# EasyEDA Pro project mouse.eprj

# Schematic Schematic1

## Sheets
1 P1: Board Name: Board1; Create Date: 2025-05-03; Page Name: P1; Project Name: mouse; Schematic Name: Schematic1; Update Date: 2025-05-28; Company: 嘉立创EDA; Page Size: A4; Version: V1.0
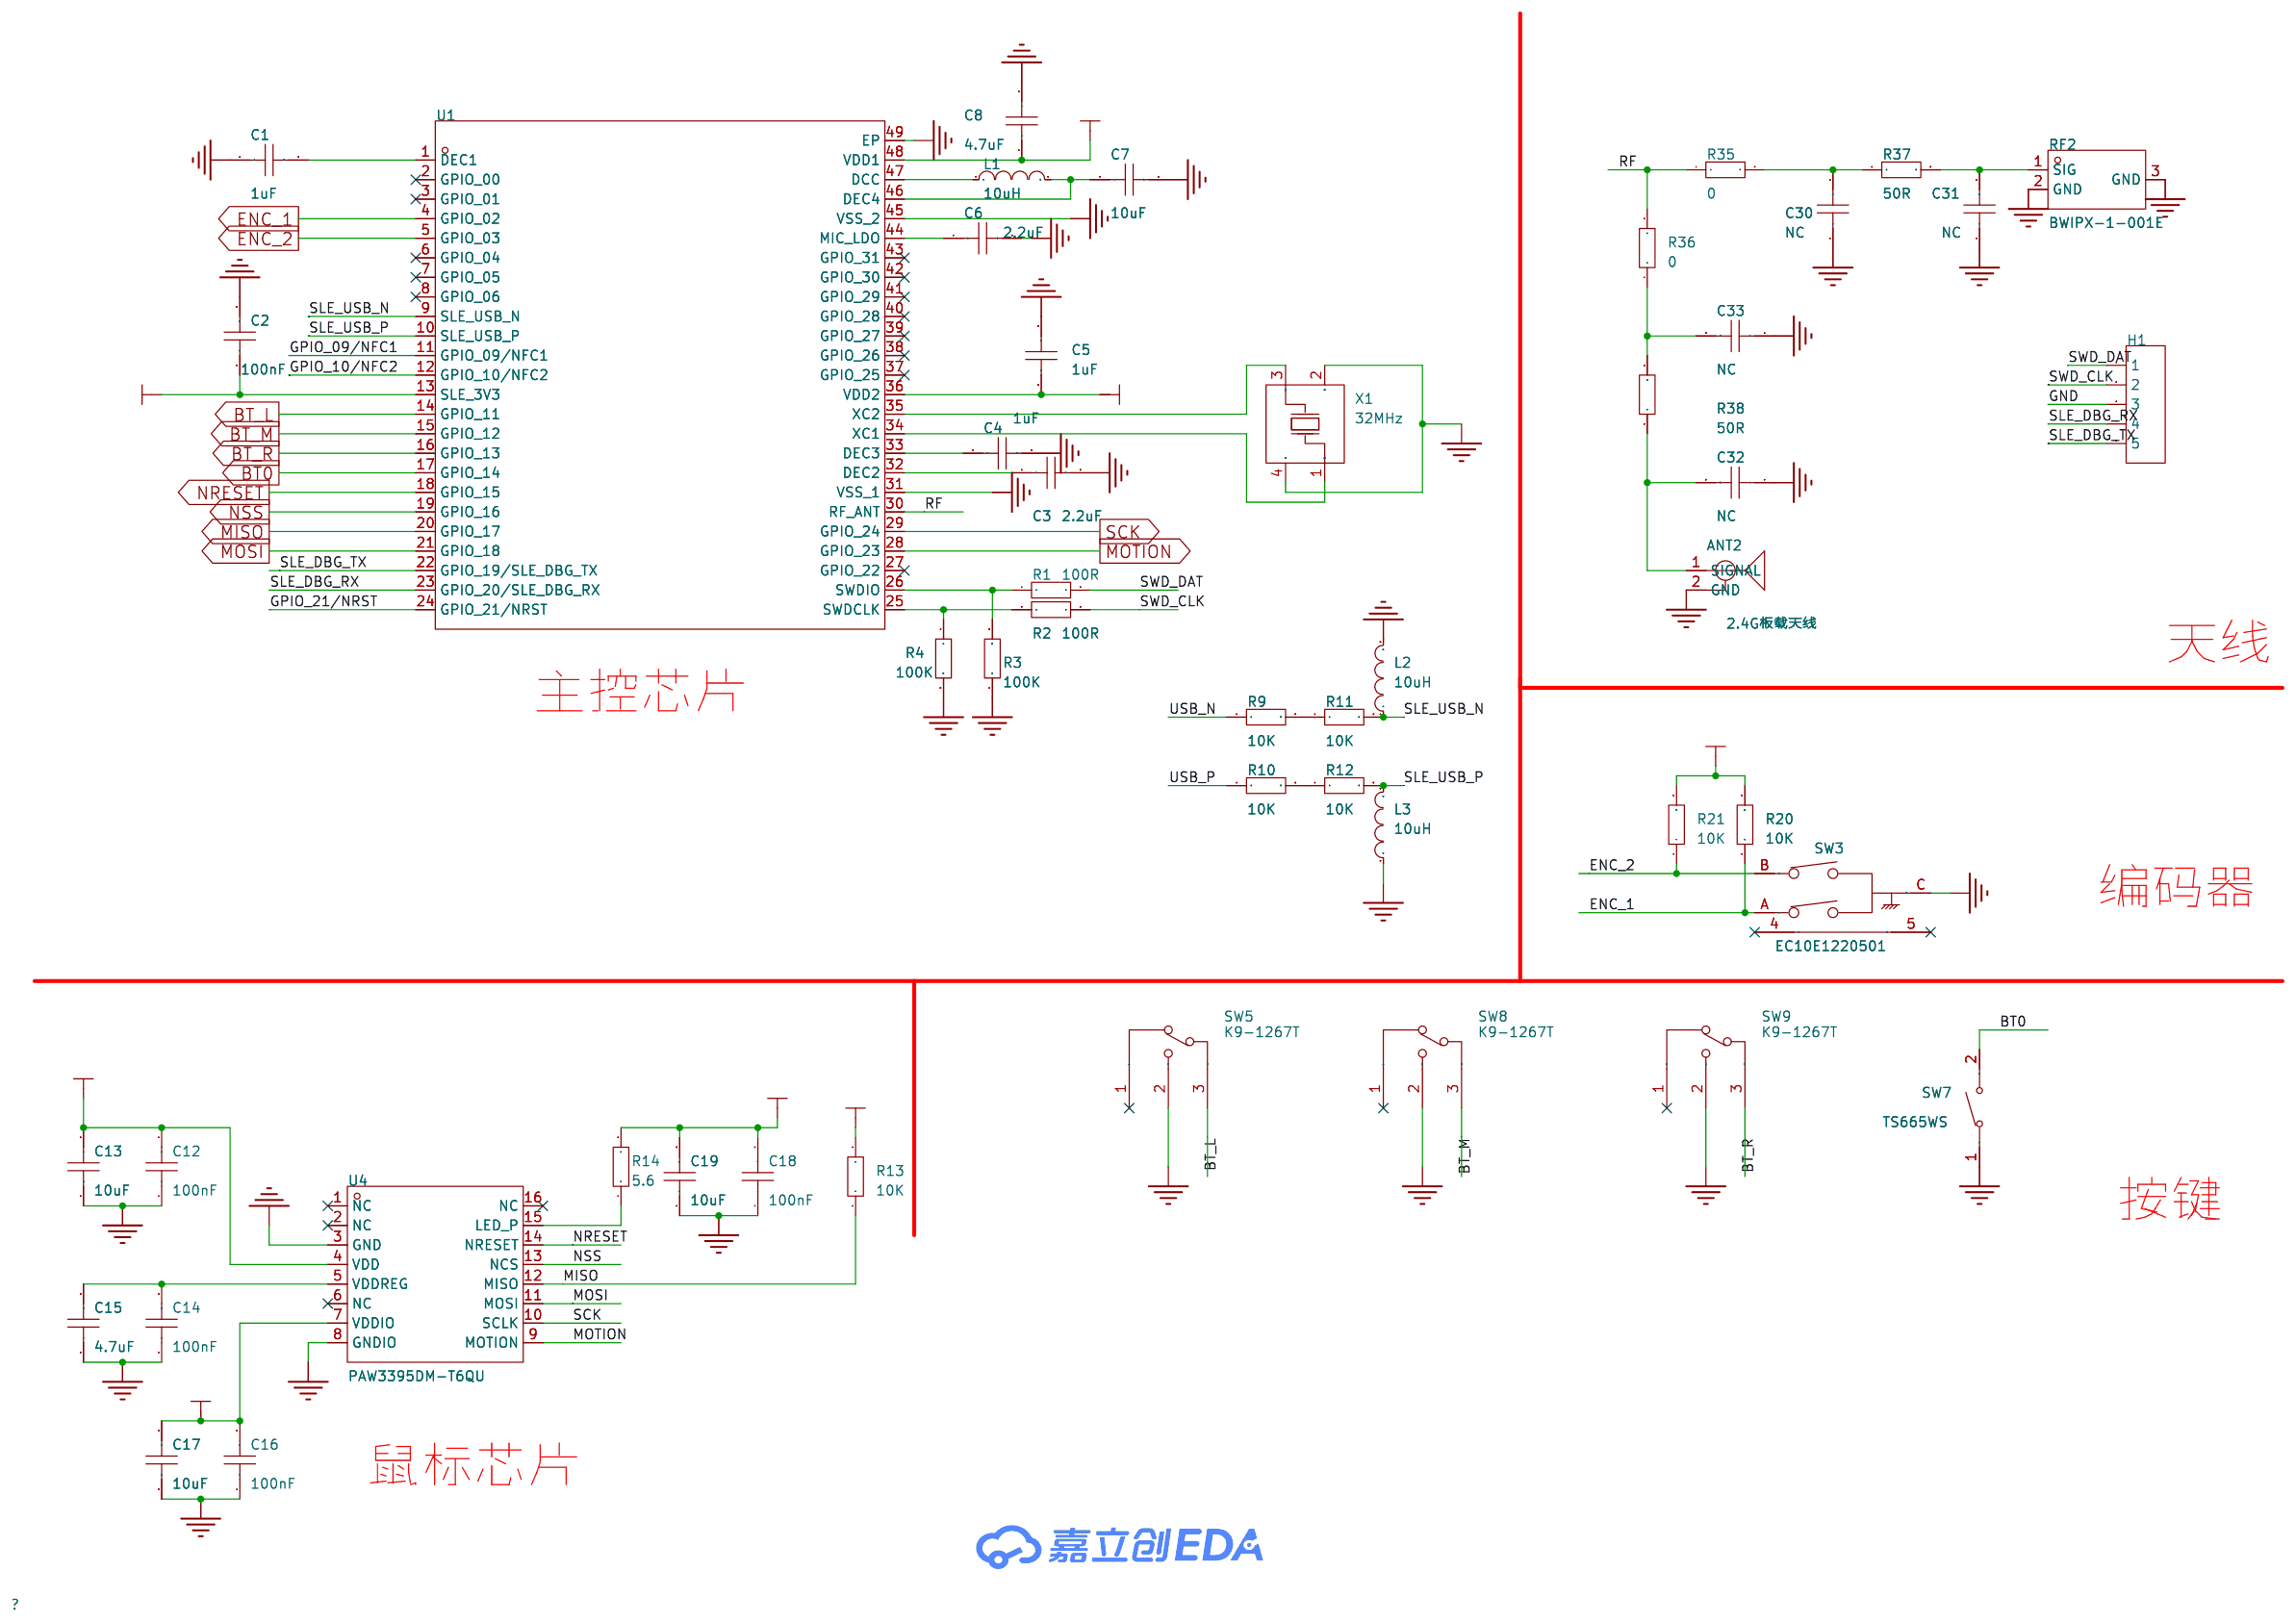
[diagram p0: P1]
2 P2: Page Name: P2; Update Date: 2025-05-03
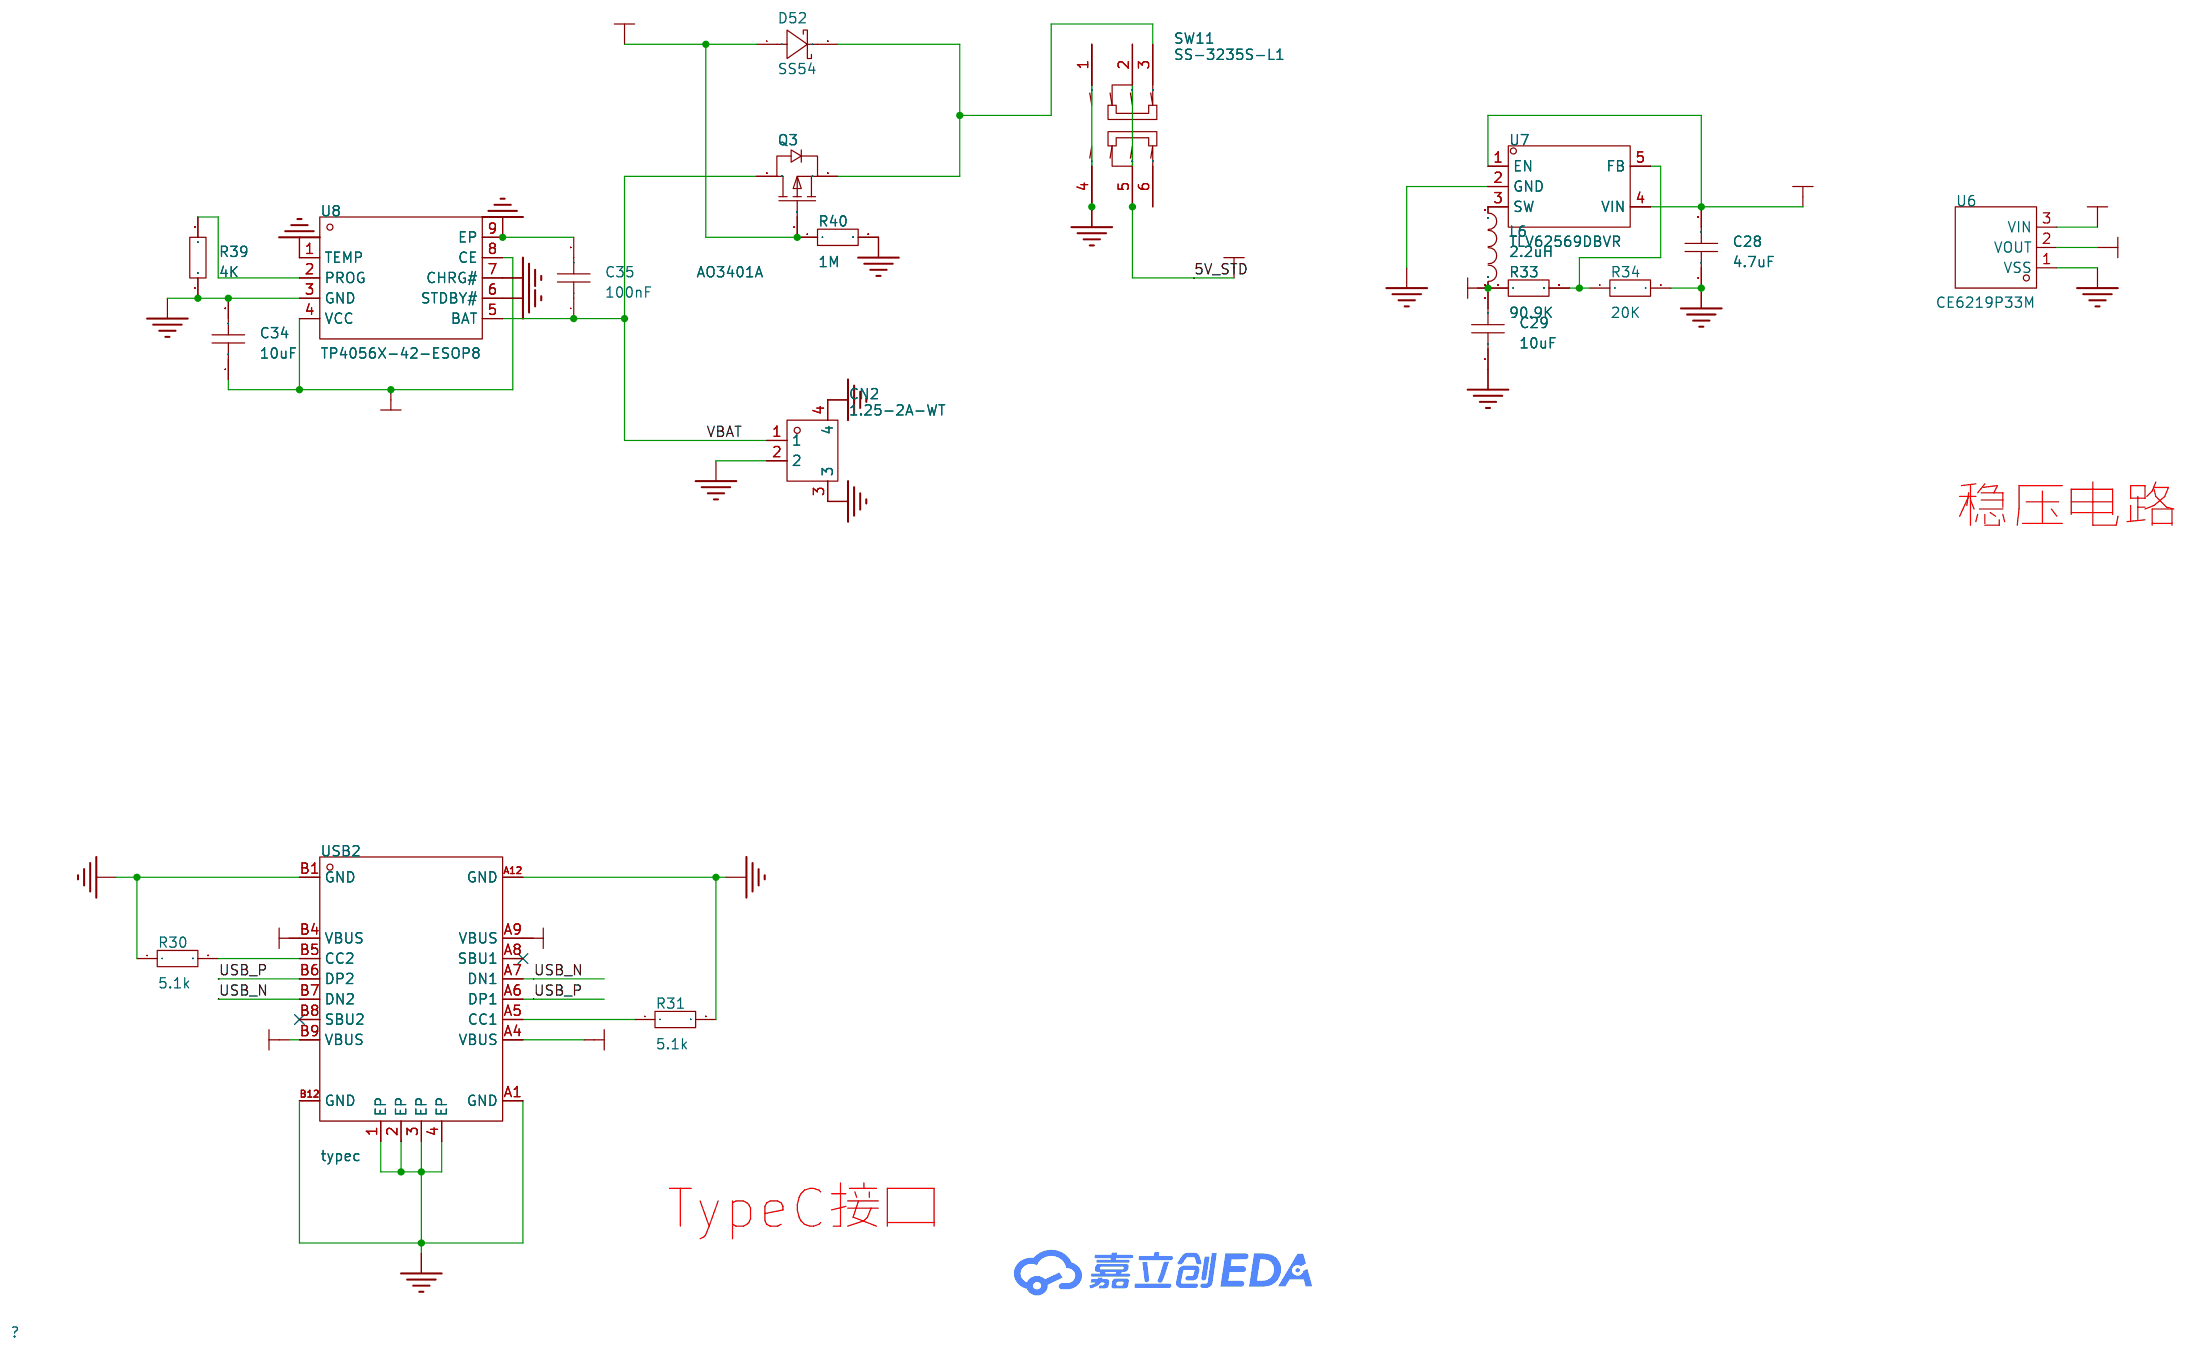
[diagram p1: P2]

## Parts
sheet P1
ANT2  2.4G板载天线  [ANT-2.4G]
C1  1uF  [C0402]
C2  100nF  [C0402]
C3  2.2uF  [C0402]
C4  1uF  [C0402]
C5  1uF  [C0402]
C6  2.2uF  [C0402]
C7  10uF  [C0603]
C8  4.7uF  [C0402]
C12  100nF  [C0603]
C13  10uF  [C0603]
C14  100nF  [C0603]
C15  4.7uF  [C0603]
C16  100nF  [C0603]
C17  10uF  [C0603]
C18  100nF  [C0603]
C19  10uF  [C0603]
C30  NC  [C0201]
C31  NC  [C0201]
C32  NC  [C0201]
C33  NC  [C0201]
H1  -  [HDR-TH_5P-P2.54-V-F]
L1  10uH  [L0805]
L2  10uH  [L0402]
L3  10uH  [L0402]
R1  100R  [R0402]
R2  100R  [R0402]
R3  100K  [R0402]
R4  100K  [R0402]
R9  10K  [R0402]
R10  10K  [R0402]
R11  10K  [R0402]
R12  10K  [R0402]
R13  10K  [R0603]
R14  5.6  [R0603]
R20  10K  [R0603]
R21  10K  [R0603]
R35  0  [R0201]
R36  0  [R0201]
R37  50R  [R0201]
R38  50R  [R0201]
RF2  BWIPX-1-001E  [IPEX-SMD_BWIPX-1-001E]
SW3  EC10E1220501  [SW-TH_EC10EXXXXXXX]
SW5  K9-1267T  [SW-TH_K9-1267T]
SW7  TS665WS  [SW-SMD_L6.0-W6.0-LS6.6]
SW8  K9-1267T  [SW-TH_K9-1267T]
SW9  K9-1267T  [SW-TH_K9-1267T]
U1  -  [QFN-48_L6.0-W6.0-P0.40-TL-EP4.4]
U4  PAW3395DM-T6QU  [DIP-16_PAW3395DM-T6QU]
X1  32MHz  [OSC-SMD_4P-L2.0-W1.6-BL]
sheet P2
C28  4.7uF  [C0603]
C29  10uF  [C0603]
C34  10uF  [C0603]
C35  100nF  [C0402]
CN2  1.25-2A-WT  [CONN-TH_1.25-2A-WT]
D52  SS54  [SMA_L4.3-W2.6-LS5.0-FD]
L6  2.2uH  [IND-SMD_L4.4-W4.2]
Q3  AO3401A  [SOT-23_L2.9-W1.3-P1.90-LS2.4-BR]
R30  5.1k  [R0603]
R31  5.1k  [R0603]
R33  90.9K  [R0402]
R34  20K  [R0402]
R39  4K  [R0402]
R40  1M  [R0402]
SW11  SS-3235S-L1  [SW-SMD_SS-3235S-LX]
U6  CE6219P33M  [SOT-23-3_L2.9-W1.6-P1.90-LS2.8-BR]
U7  TLV62569DBVR  [SOT-23-5_L3.0-W1.7-P0.95-LS2.8-BR]
U8  TP4056X-42-ESOP8  [SOP-8_L4.9-W3.9-P1.27-LS6.0-TL-EP]
USB2  typec  [USB-C-SMD_KH-TYPE-C-16P]

## Library data of the parts
ANT2 = 2.4G板载天线
C1-C6 C8 C28-C35 = CAP_0402: Supplier Footprint: 0402
C7 C12-C19 = CAP_0603: Supplier Footprint: 0603
H1 = HDR-F_2.54_1x5P: Supplier Part: C50950; Supplier Footprint: 插件
L1 = L_0805
L2 L3 = L_0603: Supplier Footprint: L0603
R1-R4 R33 R34 R39 R40 = Res_0402: Supplier Footprint: 0402
R9-R14 R20 R21 R30 R31 = Res_0603: Supplier Footprint: 0603
R35-R38 = Res_0201: Supplier Footprint: 0201
RF2 = BWIPX-1-001E: 连接器类型:板端;接口类型:内针;端口数量:1;接口直径:-;接口长度/高度:-;频率-最大值:6GHz;射频系列:IPEX;阻抗:50Ω;样式:-;工作温度范围:-;; LCSC Part Name: IPEX 内针; Supplier Part: C496552; Manufacturer: BAT WIRELESS(蝙蝠无线); Supplier Footprint: SMD; JLCPCB Part Class: Extended Part; Datasheet: https://atta.szlcsc.com/upload/public/pdf/source/20201223/C496552_05E5A9956EAE1A8819C5051D085B1DED.pdf; Supplier: LCSC; Connector Type: 板端; Interface Type: 内针; Number of Ports: 1; Frequency-Max: 6GHz; RF Series: IPEX; Impedance: 50Ω
SW3 = EC10E1220501: 10型贯通轴型; Supplier Part: C160889; Manufacturer: ALPSALPINE(阿尔卑斯阿尔派); Supplier Footprint: 插件; JLCPCB Part Class: 扩展库; Datasheet: https://atta.szlcsc.com/upload/public/pdf/source/20180227/C160889_15197014267581370273.pdf; Supplier: LCSC
SW5 SW8 SW9 = K9-1267T: 类型:微动开关;电路结构:单刀双掷;额定电流(DC):100mA;额定电压(DC):30V;额定电流(AC):-;额定电压(AC):-;机械寿命:300万次;; LCSC Part Name: 12.7*5.7*7.5mm 插件微动开关; Supplier Part: C107266; Manufacturer: 韩国韩荣; Supplier Footprint: 插件; JLCPCB Part Class: 扩展库; Datasheet: https://atta.szlcsc.com/upload/public/pdf/source/20170413/1492062748888.pdf; Supplier: LCSC; Type: 微动开关; Circuit: 单刀双掷; Switch Length: 12.7mm; Switch Width: 5.7mm; Switch Height: 7.5mm; Contact Current (DC): 100mA; Voltage Rating (DC): 30V; Mechanical Life: 300万次; Operating Temperature: -25℃~+85℃
SW7 = TS665WS_C398058: 电路结构:单刀单掷;按钮形状:圆形按钮;作用力:200gf;安装方式:立贴;开关长度:6mm;开关宽度:6mm;开关高度:5mm;触点电流:50mA;额定电压(DC):12V;带灯:-;机械寿命:-;; LCSC Part Name: 6*6*5mm 立贴 轻触开关; Supplier Part: C398058; Manufacturer: SHOU HAN(首韩); Supplier Footprint: SMD; JLCPCB Part Class: 扩展库; Datasheet: https://atta.szlcsc.com/upload/public/pdf/source/20190620/C398058_75EC11C2CCBC6DD113AE79D58CB25A40.pdf; Supplier: LCSC; Circuit: 单刀单掷; Actuator Style: 圆形按钮; Operating Force: 200gf; Mounting Style: 立贴; Switch Length: 6mm; Switch Width: 6mm; Switch Height: 5mm; Contact Current: 50mA; Voltage Rating (DC): 12V
U1 = hi2821: Manufacturer: 海思; Supplier Footprint: QFN-48; JLCPCB Part Class: 扩展库
U4 = PAW3395DM-T6QU: Supplier Part: C9900026543; Supplier Footprint: 16-PDIP; Supplier: LCSC
X1 = X201632MKD4SI: 晶振类型:贴片晶振;频率:32MHz;常温频差:±20ppm;外接负载电容:8pF;频率稳定度(全温):±20ppm;; LCSC Part Name: 32MHz ±20ppm 8pF 停产; Supplier Part: C108165; Manufacturer: YXC(扬兴晶振); Supplier Footprint: SMD2016-4P; JLCPCB Part Class: 扩展库; Datasheet: https://atta.szlcsc.com/upload/public/pdf/source/20210329/C108154_97241DDF47B5B71D7D93F8906D63DA2F.pdf; Supplier: LCSC; Crystal Type: 贴片晶振; Normal temperature Frequency Tolerance: ±20ppm; External load capacitor: 8pF; Frequency Stability(Full temperature range): ±20ppm; Operating Temperature: -40℃~+85℃
CN2 = 1.25-2A-WT: 插针结构:1x2P;间距:1.25mm;安装方式:卧贴;参考系列:-;总PIN数:2P;排数:1;每排PIN数:2;行距:-;额定电流:500mA;工作温度范围:-25℃~+85℃;; LCSC Part Name: 1x2P 间距:1.25mm 卧贴; Supplier Part: C722596; Manufacturer: CAX(创都); Supplier Footprint: SMD,P=1.25mm,卧贴; JLCPCB Part Class: 扩展库; Datasheet: https://atta.szlcsc.com/upload/public/pdf/source/20200831/C722596_8E06BADB8DB7299BF643CBA8EAB94548.pdf; Supplier: LCSC; Pins Structure: 1x2P; Pitch: 1.25mm; Mounting Style: 卧贴; Number of Pins: 2P; Number of Rows: 1; Number of PINs Per Row: 2; Current Rating (Max): 500mA; Operating Temperature Range: -25℃~+85℃
D52 = SS54_C7420369: 二极管配置:独立式;正向压降(Vf):550mV@5.0A;直流反向耐压(Vr):40V;整流电流:5A;; LCSC Part Name: 电压:40V 电流:5A; Supplier Part: C7420369; Manufacturer: 宏迦橙; Supplier Footprint: SMA(DO-214AC); JLCPCB Part Class: 扩展库; Datasheet: https://atta.szlcsc.com/upload/public/pdf/source/20230828/254C3882F8647358AD9F60DD73611B5E.pdf; Supplier: LCSC; Diode Configuration: 独立式; Forward Voltage (Vf@If): 550mV@5.0A; Reverse Voltage (Vr): 40V; Rectified Current: 5A; Reverse Leakage Current (Ir): 50uA@40V
L6 = FXL0420-2R2-M: 电感值:2.2uH;精度:±20%;额定电流:4.5A;饱和电流(Isat):5A;类型:一体成型电感;; LCSC Part Name: 2.2uH ±20% 5A; Supplier Part: C167206; Manufacturer: cjiang(长江微电); Supplier Footprint: SMD,4.2x4.4mm; JLCPCB Part Class: 扩展库; Datasheet: https://atta.szlcsc.com/upload/public/pdf/source/20240426/3189EA8206330E2108542F9E34E540E7.pdf; Supplier: LCSC; Tolerance: ±20%; Rated Current: 4.5A; Saturation Current (Isat): 5A; DC Resistance (DCR): 58mΩ; Type: 一体成型电感
Q3 = AO3401A_C15127: 类型:1个P沟道;漏源电压(Vdss):30V;连续漏极电流(Id):4A;导通电阻(RDS(on)@Vgs,Id):44mΩ@10V,4.3A;功率(Pd):1.4W;阈值电压(Vgs(th)@Id):1.3V@250uA;; LCSC Part Name: 1个P沟道 耐压:30V 电流:4A; Supplier Part: C15127; Manufacturer: AOS; Supplier Footprint: SOT-23; JLCPCB Part Class: 基础库; Datasheet: https://atta.szlcsc.com/upload/public/pdf/source/20160507/1462613609053.pdf; Supplier: LCSC; Type: 1个P沟道; Drain Source Voltage (Vdss): 30V; Continuous Drain Current (Id): 4A; Drain Source On Resistance (RDS(on)@Vgs,Id): 44mΩ@10V,4.3A; Power Dissipation (Pd): 1.4W; Gate Threshold Voltage (Vgs(th)@Id): 1.3V@250uA; Total Gate Charge (Qg@Vgs): 12.2nC@4.5V; Input Capacitance (Ciss@Vds): 1.2nF@15V; Operating Temperature: -55℃~+150℃@(Tj)
SW11 = SS-3235S-L1: 电路结构:双刀双掷;安装方式:卧贴;开关颜色:黑色;额定电流(DC):50mA;额定电压(DC):12V;额定电流(AC):50mA;额定电压(AC):12V;机械寿命:1万次;; LCSC Part Name: 柄长2mm 卧贴双档 滑动开关; Supplier Part: C500055; Manufacturer: XKB Connectivity(中国星坤); Supplier Footprint: SMD; JLCPCB Part Class: 扩展库; Datasheet: https://atta.szlcsc.com/upload/public/pdf/source/20211011/39D516E750C13BE9339464E723D9F132.pdf; Supplier: LCSC; Circuit: 双刀双掷; Actuator Style: 矩形柱状; Pin Style: 鸥翼型; Switch Length: 9.1mm; Switch Width: 3.55mm; Switch Height: 3.2mm; Mounting Style: 卧贴; Actuator Color: 黑色; Current Rating (DC): 50mA; Voltage Rating (DC): 12V; Current Rating (AC): 50mA; Voltage Rating (AC): 12V; Mechanical Life: 1万次; Operating Temperature: -40℃~+85℃
U6 = CE6219P33M: Supplier Part: C9900023885; Supplier Footprint: SOT-23; JLCPCB Part Class: 扩展库; Supplier: LCSC
U7 = TLV62569DBVR: 功能类型:降压型;输出类型:可调;输入电压:2.5V~5.5V;输出电压:600mV~5.5V;输出电流(最大值):2A;; Supplier Part: C141836; Manufacturer: TI(德州仪器); Supplier Footprint: SOT-23-5; JLCPCB Part Class: 扩展库; Datasheet: https://www.ti.com/cn/lit/gpn/tlv62569; Supplier: LCSC; Function: 降压型; Output Type: 可调; Input Voltage: 2.5V~5.5V; Output Voltage: 600mV~5.5V; Output Current (Max): 2A; Switching Frequency: 1.5MHz; Operating Temperature: -40℃~+125℃@(TJ); Synchronous Rectification: 是; Topology: 降压式; Switch tube (built-in/external): 内置
U8 = TP4056X-42-ESOP8: Supplier Part: C2763448; Manufacturer: TOPPOWER(南京拓微); Supplier Footprint: SOP-8-EP; JLCPCB Part Class: 扩展库; Datasheet: https://atta.szlcsc.com/upload/public/pdf/source/20221111/3D7D53D5011BF4ED4C4D0D9BFDBB1404.pdf; Supplier: LCSC
USB2 = typec: Supplier Part: C9900016956; Supplier Footprint: typec 12p; JLCPCB Part Class: 扩展库; Supplier: LCSC

## Nets
5V: C34.1 D52.1(A) Q3.1(G) R20.2 R21.2 R40.1 U8.4(VCC) U8.8(CE) USB2.A4(VBUS) USB2.A9(VBUS) USB2.B4(VBUS) USB2.B9(VBUS)
5V_STD: C28.2 SW11.2 SW11.5 U7.1(EN) U7.4(VIN)
GND: ANT2.2(GND) C1.1 C2.2 C3.2 C4.2 C5.2 C6.2 C7.2 C8.2 C12.1 C13.1 C14.1 C15.1 C16.1 C17.1 C18.1 C19.1 C28.1 C29.1 C30.1 C31.1 C32.1 C33.1 C34.2 C35.2 CN2.2 CN2.3 CN2.4 H1.3 L2.2 L3.1 R3.1 R4.2 R30.1 R31.2 R34.2 R39.1 R40.2 RF2.2(GND) RF2.3(GND) SW3.C SW5.2(ON) SW7.1(A) SW8.2(ON) SW9.2(ON) SW11.1 SW11.4 U1.31(VSS_1) U1.45(VSS_2) U1.49(EP) U4.3(GND) U4.8(GNDIO) U6.1(VSS) U7.2(GND) U8.1(TEMP) U8.3(GND) U8.6(STDBY#) U8.7(CHRG#) U8.9(EP) USB2.1(EP) USB2.2(EP) USB2.3(EP) USB2.4(EP) USB2.A1(GND) USB2.A12(GND) USB2.B1(GND) USB2.B12(GND) X1.2(GND) X1.4(GND)
VBAT: C35.1 CN2.1 Q3.3(D) U8.5(BAT)
VDD_1.9V: C12.2 C13.2 C18.2 C19.2 R14.2 U4.4(VDD) U6.2(VOUT)
BT0: SW7.2(B) U1.17(GPIO_14)
BT_L: SW5.3(NC) U1.14(GPIO_11)
BT_M: SW8.3(NC) U1.15(GPIO_12)
BT_R: SW9.3(NC) U1.16(GPIO_13)
ENC_1: R20.1 SW3.A U1.4(GPIO_02)
ENC_2: R21.1 SW3.B U1.5(GPIO_03)
GPIO_09/NFC1: U1.11(GPIO_09/NFC1)
GPIO_10/NFC2: U1.12(GPIO_10/NFC2)
GPIO_21/NRST: U1.24(GPIO_21/NRST)
MISO: R13.1 U1.20(GPIO_17) U4.12(MISO)
MOSI: U1.21(GPIO_18) U4.11(MOSI)
MOTION: U1.28(GPIO_23) U4.9(MOTION)
NRESET: U1.18(GPIO_15) U4.14(NRESET)
NSS: U1.19(GPIO_16) U4.13(NCS)
RF: R35.1 R36.2 U1.30(RF_ANT)
SCK: U1.29(GPIO_24) U4.10(SCLK)
SLE_3V3: C2.1 C5.1 C8.1 C16.2 C17.2 C29.2 L6.2 R13.2 R33.1 U1.13(SLE_3V3) U1.36(VDD2) U1.48(VDD1) U4.7(VDDIO) U6.3(VIN)
SLE_DBG_RX: H1.4 U1.23(GPIO_20/SLE_DBG_RX)
SLE_DBG_TX: H1.5 U1.22(GPIO_19/SLE_DBG_TX)
SLE_USB_N: L2.1 R11.2 U1.9(SLE_USB_N)
SLE_USB_P: L3.2 R12.2 U1.10(SLE_USB_P)
SWD_CLK: H1.2 R2.2
SWD_DAT: H1.1 R1.2
USB_N: R9.1 USB2.A7(DN1) USB2.B7(DN2)
USB_P: R10.1 USB2.A6(DP1) USB2.B6(DP2)
$1N1713: C6.1 U1.44(MIC_LDO)
$1N1734: C7.1 L1.2 U1.46(DEC4)
$1N1737: L1.1 U1.47(DCC)
$1N1785: R1.1 R3.2 U1.26(SWDIO)
$1N1790: R2.1 R4.1 U1.25(SWDCLK)
$1N1799: C4.1 U1.33(DEC3)
$1N1800: C3.1 U1.32(DEC2)
$1N1801: U1.34(XC1) X1.1(OSC1)
$1N1802: U1.35(XC2) X1.3(OSC2)
$1N1817: R10.2 R12.1
$1N1818: R9.2 R11.1
$1N1843: C1.2 U1.1(DEC1)
$1N2592: C14.2 C15.2 U4.5(VDDREG)
$1N2602: R14.1 U4.15(LED_P)
$1N6825: ANT2.1(SIGNAL) C32.2 R38.1
$1N6827: C33.2 R36.1 R38.2
$1N6831: C30.2 R35.2 R37.1
$1N6834: C31.2 R37.2 RF2.1(SIG)
$2N661: R31.1 USB2.A5(CC1)
$2N668: R30.2 USB2.B5(CC2)
$2N1441: R33.2 R34.1 U7.5(FB)
$2N1447: L6.1 U7.3(SW)
$2N2318: D52.2(K) Q3.2(S) SW11.3
$2N2325: R39.2 U8.2(PROG)

Not connected (* = marked no-connect by the designer): SW3 4* 5*; SW5 1(C)*; SW8 1(C)*; SW9 1(C)*; SW11 6; U1 2(GPIO_00)* 3(GPIO_01)* 6(GPIO_04)* 7(GPIO_05)* 8(GPIO_06)* 27(GPIO_22)* 37(GPIO_25)* 38(GPIO_26)* 39(GPIO_27)* 40(GPIO_28)* 41(GPIO_29)* 42(GPIO_30)* 43(GPIO_31)*; U4 1(NC)* 2(NC)* 6(NC)* 16(NC)*; USB2 A8(SBU1)* B8(SBU2)*

## Notes on the sheets
sheet 1
- 天线
- 主控芯片
- 编码器
- 按键
- 鼠标芯片
sheet 2
- 稳压电路
- TypeC接口

# Board PCB1_1
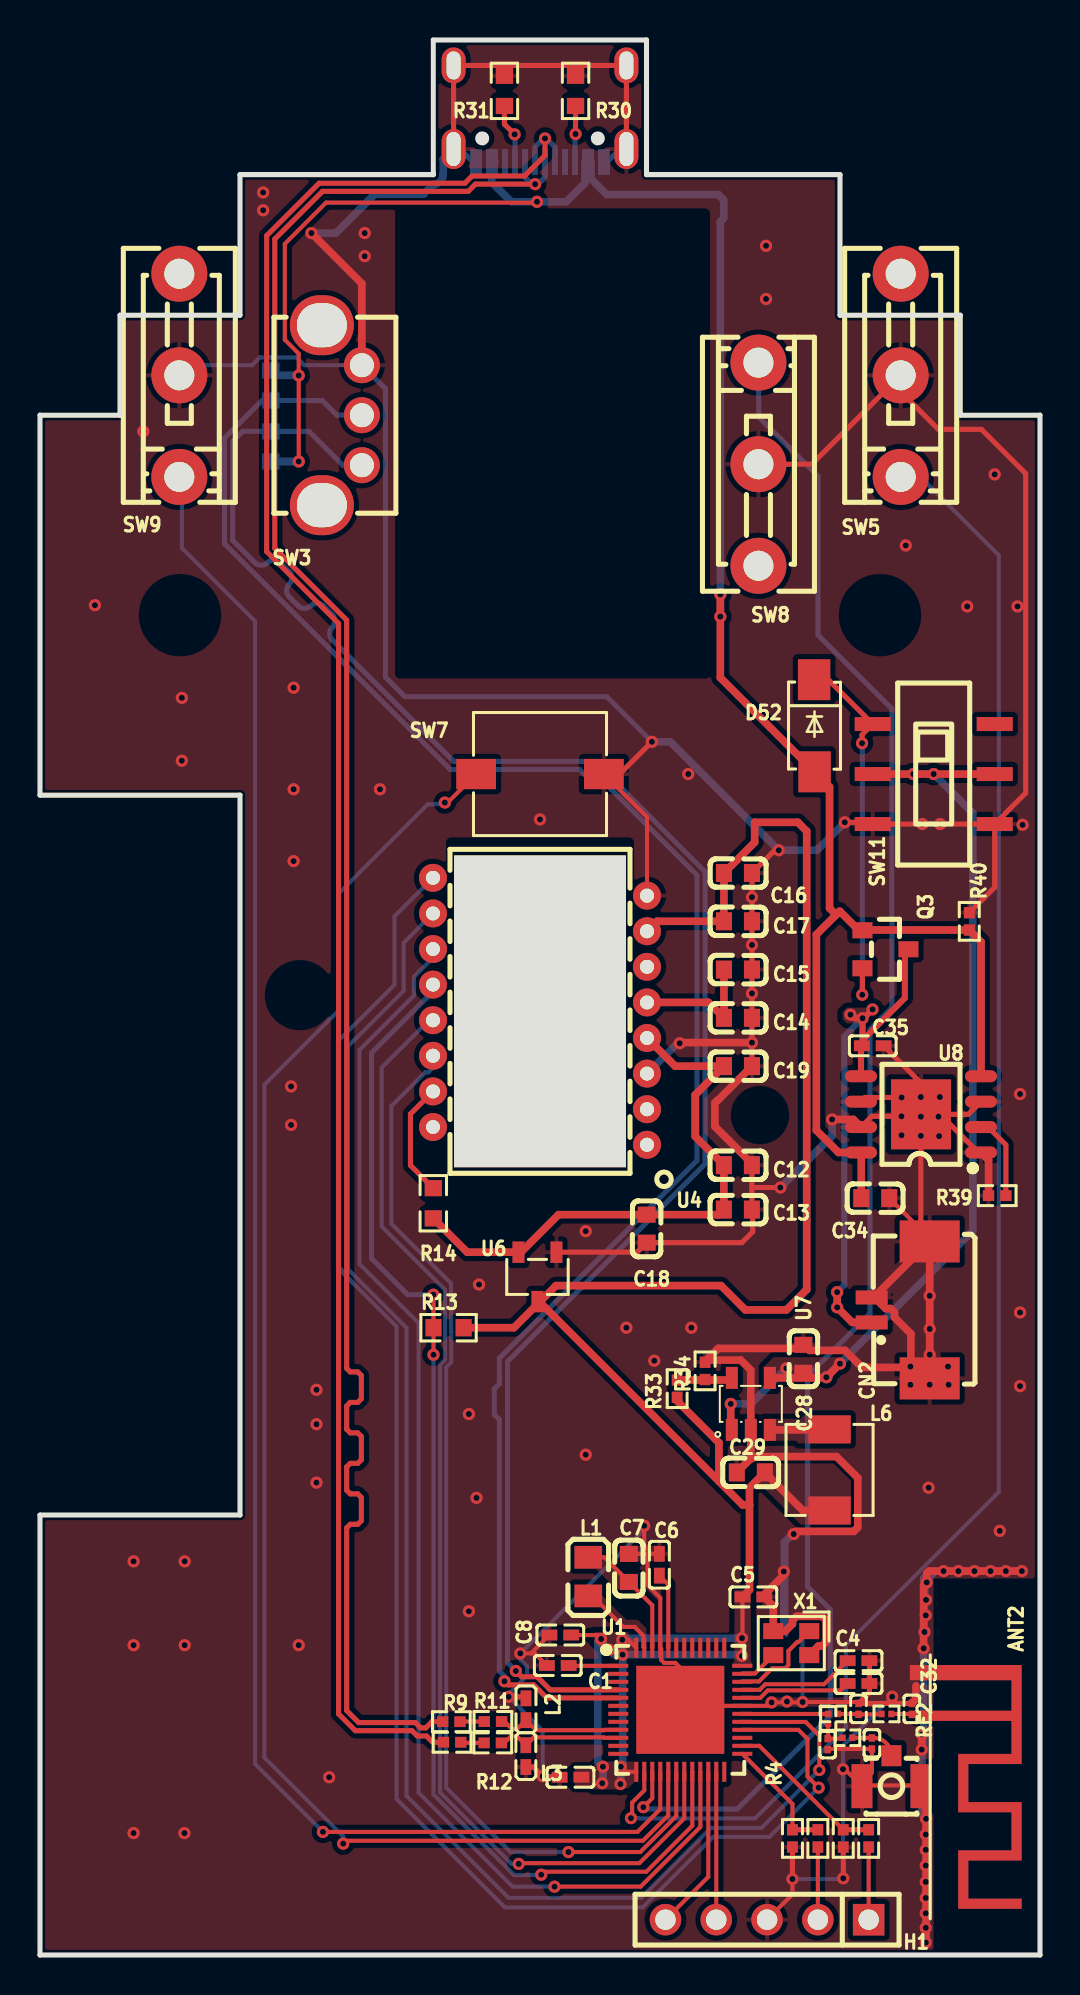
[diagram p2: board, top side]
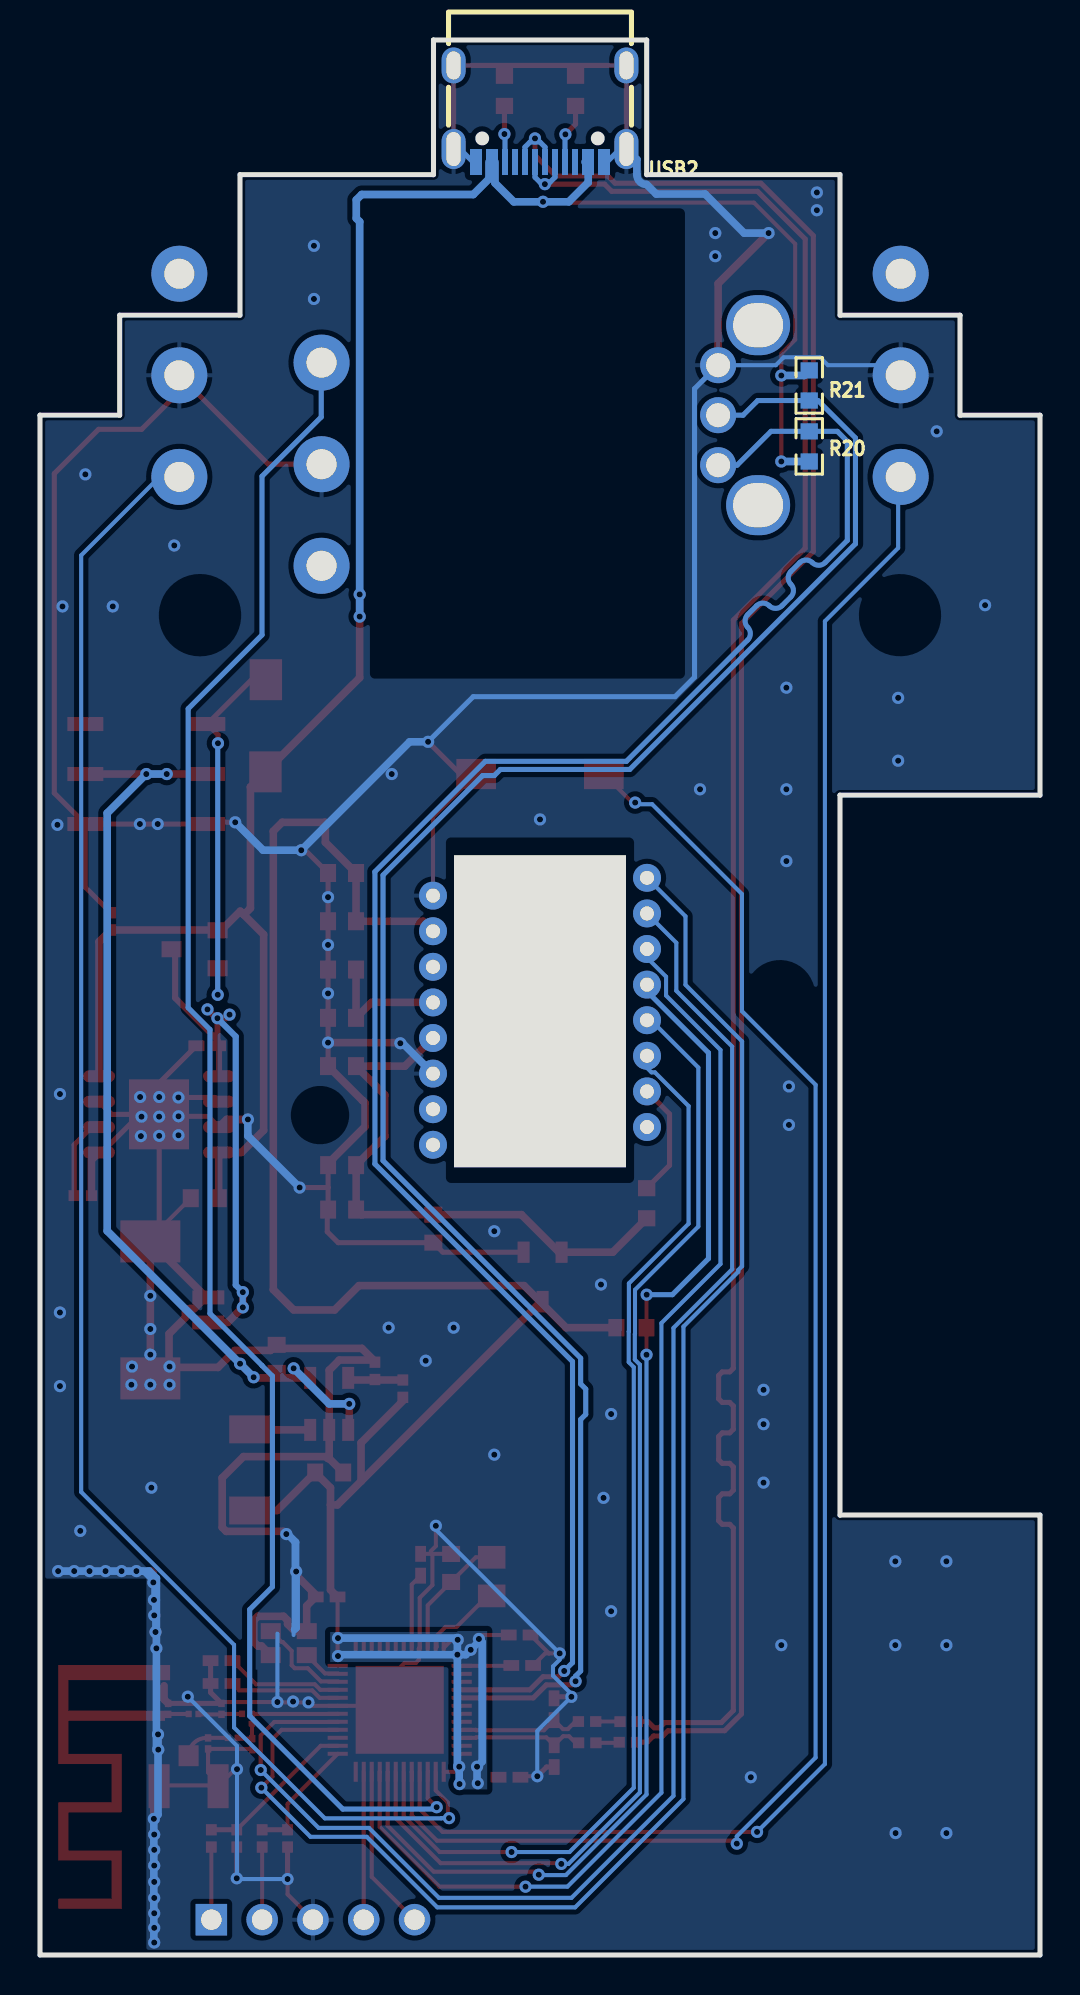
[diagram p3: board, bottom side, seen from below]

Outline 50 x 95.76 mm; copper layers: Top Layer, Bottom Layer. Coordinates in mm from the lower left corner of the outline.
Outline path: 0,77 4,77 4,82 10,82 10,89.03 19.67,89.03 19.67,95.76 30.33,95.76 30.33,89.03 40,89.03 40,82 46.02,82 46.02,77 50,77 50,0 0,0 0,22 10,22 10,58 0,58 0,77
Stack: Top Layer 0.035mm / Dielectric1 1.51mm FR4 er 4.5 / Bottom Layer 0.035mm

## Design rules (mm)
net ENC_2: DP2
net ENC_1: DP2
net USB_N: DP3
net USB_P: DP3
net SLE_USB_N: DP4
net SLE_USB_P: DP4
template: JLCPCB Capability(Two Layers Board)
spacing copperThickness1oz (default): track to track 0.102, other pairs 0.152 to 0.3
spacing copperThickness2oz: track to track 0.203, other pairs 0.152 to 0.3
track width copperThickness1oz (default): min 0.127, default 0.254, max 2.54
track width copperThickness2oz: min 0.203, default 0.254, max 2.54
differential pair differentialPair (default): width min 0.127, default 0.254, max 2.54; gap min 0.152, default 0.152
via viaSize (default): diameter min 0.5, default 0.61, max 10; hole min 0.3, default 0.305, max 6.3

## Placement (name value [footprint] x y rotation side)
ANT2  2.4G板载天线  [ANT-2.4G]  44 12.98 270 top
C1  1uF  [C0402]  25.89 14.48 0 top
C2  100nF  [C0402]  26.52 8.89 180 top
C3  2.2uF  [C0402]  40.93 13.58 0 top
C4  1uF  [C0402]  40.93 14.72 0 top
C5  1uF  [C0402]  35.67 17.91 0 top
C6  2.2uF  [C0402]  30.97 19.52 90 top
C7  10uF  [C0603]  29.44 19.36 90 top
C8  4.7uF  [C0402]  26.02 16 180 top
C12  100nF  [C0603]  34.89 39.5 180 top
C13  10uF  [C0603]  34.89 37.28 180 top
C14  100nF  [C0603]  34.9 46.86 180 top
C15  4.7uF  [C0603]  34.9 49.28 180 top
C16  100nF  [C0603]  34.9 54.11 180 top
C17  10uF  [C0603]  34.9 51.69 180 top
C18  100nF  [C0603]  30.33 36.32 90 top
C19  10uF  [C0603]  34.9 44.45 180 top
C28  4.7uF  [C0603]  38.17 29.81 270 top
C29  10uF  [C0603]  35.54 24.13 0 top
C30  NC  [C0201]  39.38 10.55 90 top
C31  NC  [C0201]  41.6 10.58 90 top
C32  NC  [C0201]  43.59 12.31 270 top
C33  NC  [C0201]  40.93 12.31 270 top
C34  10uF  [C0603]  41.76 37.85 0 top
C35  100nF  [C0402]  41.64 45.47 0 top
CN2  1.25-2A-WT  [CONN-TH_1.25-2A-WT]  43.03 32.26 90 top
D52  SS54  [SMA_L4.3-W2.6-LS5.0-FD]  38.72 61.47 90 top
H1  -  [HDR-TH_5P-P2.54-V-F]  36.35 1.77 180 top
L1  10uH  [L0805]  27.41 18.92 90 top
L2  10uH  [L0402]  24.3 12.29 90 top
L3  10uH  [L0402]  24.29 9.95 90 top
L6  2.2uH  [IND-SMD_L4.4-W4.2]  39.48 24.26 90 top
Q3  AO3401A  [SOT-23_L2.9-W1.3-P1.90-LS2.4-BR]  42.27 50.29 180 top
R1  100R  [R0402]  41.43 5.83 270 top
R2  100R  [R0402]  38.89 5.83 270 top
R3  100K  [R0402]  40.16 5.83 90 top
R4  100K  [R0402]  37.62 5.83 270 top
R9  10K  [R0402]  20.57 11.67 0 top
R10  10K  [R0402]  20.6 10.64 0 top
R11  10K  [R0402]  22.65 11.68 0 top
R12  10K  [R0402]  22.64 10.61 0 top
R13  10K  [R0603]  20.43 31.37 0 top
R14  5.6  [R0603]  19.67 37.59 270 top
R20  10K  [R0603]  11.54 75.44 270 bottom
R21  10K  [R0603]  11.54 78.49 90 bottom
R30  5.1k  [R0603]  26.78 93.22 270 top
R31  5.1k  [R0603]  23.22 93.22 90 top
R33  90.9K  [R0402]  31.86 28.32 90 top
R34  20K  [R0402]  33.25 29.21 90 top
R35  0  [R0201]  39.4 11.8 270 top
R36  0  [R0201]  39.66 12.05 180 top
R37  50R  [R0201]  40.37 10.86 0 top
R38  50R  [R0201]  42.32 12.05 180 top
R39  4K  [R0402]  47.86 37.97 0 top
R40  1M  [R0402]  46.46 51.69 90 top
RF2  BWIPX-1-001E  [IPEX-SMD_BWIPX-1-001E]  42.57 9.2 270 top
SW3  EC10E1220501  [SW-TH_EC10EXXXXXXX]  15.09 77 90 top
SW5  K9-1267T  [SW-TH_K9-1267T]  43.03 78.99 270 top
SW7  TS665WS  [SW-SMD_L6.0-W6.0-LS6.6]  25 59.06 180 top
SW8  K9-1267T  [SW-TH_K9-1267T]  35.92 74.55 90 top
SW9  K9-1267T  [SW-TH_K9-1267T]  6.97 78.99 270 top
SW11  SS-3235S-L1  [SW-SMD_SS-3235S-LX]  44.69 59.06 90 top
U1  -  [QFN-48_L6.0-W6.0-P0.40-TL-EP4.4]  32.01 12.26 0 top
U4  PAW3395DM-T6QU  [DIP-16_PAW3395DM-T6QU]  25 47.19 180 top
U6  CE6219P33M  [SOT-23-3_L2.9-W1.6-P1.90-LS2.8-BR]  24.87 33.91 90 top
U7  TLV62569DBVR  [SOT-23-5_L3.0-W1.7-P0.95-LS2.8-BR]  35.54 27.56 270 top
U8  TP4056X-42-ESOP8  [SOP-8_L4.9-W3.9-P1.27-LS6.0-TL-EP]  44.05 42.04 180 top
USB2  typec  [USB-C-SMD_KH-TYPE-C-16P]  25 92.08 0 bottom
X1  32MHz  [OSC-SMD_4P-L2.0-W1.6-BL]  37.56 15.59 180 top

## Footprints (pads in the part's own frame, mm; a bottom-side part is the same pattern mirrored in y, then rotated)
ANT-2.4G
  rect 0.508x0.508 smd: 1(1.016,0)
  rect 0.762x0.762 smd: 2(-1.143,-0.127)
C0201
  rect 0.368x0.324 smd: 1(-0.275,0) 2(0.275,0)
C0402
  rect 0.79x0.54 smd: 1(-0.545,0) 2(0.545,0)
C0603
  rect 0.8x0.9 smd: 1(-0.7,0) 2(0.7,0)
CONN-TH_1.25-2A-WT
  rect 0.7x1.6 smd: 1(-0.625,1.45) 2(0.625,1.45)
  rect 2.1x3 smd: 3(3.425,-1.45) 4(-3.425,-1.45)
DIP-16_PAW3395DM-T6QU
  round 1.4 hole 0.7: 1(-5.35,6.675) 2(-5.35,4.895) 3(-5.35,3.115) 4(-5.35,1.335) 5(-5.35,-0.445) 6(-5.35,-2.225) 7(-5.35,-4.005) 8(-5.35,-5.785) 9(5.35,-6.675) 10(5.35,-4.895) 11(5.35,-3.115) 12(5.35,-1.335) 13(5.35,0.445) 14(5.35,2.225) 15(5.35,4.005) 16(5.35,5.785)
HDR-TH_5P-P2.54-V-F
  rect 1.575x1.575 hole 1.02: 1(-5.08,0)
  round 1.575 hole 1.02: 2(-2.54,0) 3(0,0) 4(2.54,0) 5(5.08,0)
IND-SMD_L4.4-W4.2
  rect 1.4x2.12 smd: 1(2.028,0) 2(-2.028,0)
IPEX-SMD_BWIPX-1-001E
  rect 1.05x1 smd: 1(-0.762,0)
  rect 2.2x1.05 smd: 2(0.762,-1.475) 3(0.762,1.475)
L0402
  rect 0.79x0.54 smd: 1(-0.545,0) 2(0.545,0)
L0805
  rect 1.133x1.377 smd: 1(-0.966,0) 2(0.966,0)
OSC-SMD_4P-L2.0-W1.6-BL
  rect 1x0.8 smd: 1(-0.9,-0.6) 2(0.9,-0.6) 3(0.9,0.6) 4(-0.9,0.6)
QFN-48_L6.0-W6.0-P0.40-TL-EP4.4
  rect 1x0.2 smd: 1(-3.1,2.2) 2(-3.1,1.8) 3(-3.1,1.4) 4(-3.1,1) 5(-3.1,0.6) 6(-3.1,0.2) 7(-3.1,-0.2) 8(-3.1,-0.6) 9(-3.1,-1) 10(-3.1,-1.4) 11(-3.1,-1.8) 12(-3.1,-2.2) 25(3.1,-2.2) 26(3.1,-1.8) 27(3.1,-1.4) 28(3.1,-1) 29(3.1,-0.6) 30(3.1,-0.2) 31(3.1,0.2) 32(3.1,0.6) 33(3.1,1) 34(3.1,1.4) 35(3.1,1.8) 36(3.1,2.2)
  rect 0.2x1 smd: 13(-2.2,-3.1) 14(-1.8,-3.1) 15(-1.4,-3.1) 16(-1,-3.1) 17(-0.6,-3.1) 18(-0.2,-3.1) 19(0.2,-3.1) 20(0.6,-3.1) 21(1,-3.1) 22(1.4,-3.1) 23(1.8,-3.1) 24(2.2,-3.1) 37(2.2,3.1) 38(1.8,3.1) 39(1.4,3.1) 40(1,3.1) 41(0.6,3.1) 42(0.2,3.1) 43(-0.2,3.1) 44(-0.6,3.1) 45(-1,3.1) 46(-1.4,3.1) 47(-1.8,3.1) 48(-2.2,3.1)
  rect 4.4x4.4 smd: 49(0,0)
R0201
  rect 0.303x0.324 smd: 1(-0.241,0) 2(0.241,0)
R0402
  rect 0.566x0.54 smd: 1(-0.433,0) 2(0.433,0)
R0603
  rect 0.806x0.864 smd: 1(-0.753,0) 2(0.753,0)
SMA_L4.3-W2.6-LS5.0-FD
  rect 2.046x1.62 smd: 1(-2.304,-0.009) 2(2.304,0.009)
SOP-8_L4.9-W3.9-P1.27-LS6.0-TL-EP
  oval 1.6x0.6 smd: 1(-3,1.905) 2(-3,0.635) 3(-3,-0.635) 4(-3,-1.905) 5(3,-1.905) 6(3,-0.635) 7(3,0.635) 8(3,1.905)
  rect 3x3.5 smd: 9(0,0)
SOT-23-3_L2.9-W1.6-P1.90-LS2.8-BR
  rect 1.07x0.6 smd: 1(1.235,-0.95) 2(1.235,0.95) 3(-1.235,0)
SOT-23-5_L3.0-W1.7-P0.95-LS2.8-BR
  rect 1.1x0.6 smd: 1(1.3,-0.95) 2(1.3,0) 3(1.3,0.95) 4(-1.3,0.95) 5(-1.3,-0.95)
SOT-23_L2.9-W1.3-P1.90-LS2.4-BR
  rect 1x0.8 smd: 1(1.15,-0.95) 2(1.15,0.95) 3(-1.15,0)
SW-SMD_L6.0-W6.0-LS6.6
  rect 1.985x1.512 smd: 1(-3.192,0) 2(3.192,0)
SW-SMD_SS-3235S-LX
  rect 0.7x1.8 smd: 1(-2.5,3.05) 2(0,3.05) 3(2.5,3.05) 4(-2.5,-3.05) 5(0,-3.05) 6(2.5,-3.05)
SW-TH_EC10EXXXXXXX
  oval 3x3.2 hole 2.2x2.5: 4(-4.5,1) 5(4.5,1)
  round 1.8 hole 1.2: A(-2.5,-1) B(0,-1) C(2.5,-1)
SW-TH_K9-1267T
  round 2.8 hole 1.5: 1(-5.08,0) 2(0,0) 3(5.08,0)
USB-C-SMD_KH-TYPE-C-16P
  oval 1.2x2 hole 0.7x1.7: 1(-4.32,1.765) 2(4.32,1.765)
  oval 1.2x1.8 hole 0.7x1.4: 3(-4.32,-2.415) 4(4.32,-2.415)
  rect 0.3x1.3 smd: A1(-3.35,2.415) A4(-2.55,2.415) A5(-1.25,2.415) A6(-0.25,2.415) A7(0.25,2.415) A8(1.25,2.415) A9(2.55,2.415) A12(3.35,2.415) B1(3.05,2.415) B4(2.25,2.415) B5(1.75,2.415) B6(0.75,2.415) B7(-0.75,2.415) B8(-1.75,2.415) B9(-2.25,2.415) B12(-3.05,2.415)

## Nets
As in the schematic.

Pads without a net: SW3 4 5; SW5 1; SW8 1; SW9 1; SW11 6; U1 2 3 6 7 8 27 37 38 39 40 41 42 43; U4 1 2 6 16; USB2 A8 B8

## Via types
v1: diameter 0.61, hole 0.305, Top Layer to Bottom Layer, 160 vias

## Routing (per net, layer and track width the routed paths; a pad name or vN(x,y) marks a point on that pad's centre or on a via; arc(x,y) is an arc through that point)
5V: length 113.4
  Top Layer w0.203: 24.75,87.63 14.3,87.63 12.24,85.57 12.24,80.77 12.94,80.08 v1(12.94,78.99) v1(12.94,74.68)
  Top Layer w0.381: C34.1 41.06,40.12 U8.8 39.93,40.13 38.82,41.24 38.82,51.03 39.81,52.02 ; 39.81,52.02 39.48,52.35 39.48,58.41 D52.1 34.02,63.87 v1(34.02,66.93) v1(34.02,68.04) ; 39.81,52.02 39.99,52.2 40.94,51.24 Q3.1 41.14,51.26 R40.1 47.05,50.67 U8.4
  Bottom Layer w0.381: USB2.B4 27.25,88.61 26.31,87.67 v1(24.85,87.67) 23.56,87.67 22.59,88.65 22.59,89.77 22.64,89.77 USB2.B9 ; USB2.A9 27.55,88.82 28.33,88.04 33.92,88.04 34.19,87.77 34.19,86.85 34.02,86.68 v1(34.02,68.04) v1(34.02,66.93) ; R20.2 v1(12.94,74.68) ; v1(12.94,78.99) 11.79,78.99 R21.2
5V_STD: length 49.8
  Top Layer w0.381: SW11.2 v1(43.66,59.06) v1(44.69,59.06) SW11.5 ; v1(40,29.57) v1(39.32,28.89) 39.29,28.86 U7.4 ; v1(34.54,27.56) 34.54,26.31 U7.1
  Bottom Layer w0.381: v1(37.32,29.34) 35.54,27.56 v1(34.54,27.56) ; v1(39.32,28.89) v1(40,29.57) 46.64,36.21 46.64,57.1 v1(44.69,59.06) v1(43.66,59.06)
GND: length 409
  Top Layer w0.203: C2.2 25.93,8.94 v1(25.13,8.94) ; v1(40.15,9.29) 40.25,9.29 41.01,8.53 ; 41.01,8.53 41.6,9.12 C31.1 39.42,10.31 C30.1 ; 41.01,8.53 41.06,8.48 ; C33.1 40.86,12.65 v1(38.13,12.65) 38.11,12.63 v1(36.58,12.63) 36.41,12.46 U1.31 32.21,12.46 U1.49 32.01,14.36 31.77,14.61 31.21,14.61 31.06,14.76 31.06,15.31 U1.45 31.01,17.86 30.38,18.5 30.38,20.06 ; 41.06,8.48 43.9,8.48 ; 41.06,8.48 RF2.2 ; H1.3 37.62,3.04 v1(37.62,3.8) ; 30.46,20.19 30.21,20.45 v1(30.21,21.46) ; C1.1 24.74,15.08 24.55,15.08 ; SW7.1 30.35,56.9 U4.8 ; 24.55,15.08 C8.2 ; 24.55,15.08 v1(24.02,15.08) ; CN2.3 44.48,35.83 44.04,36.27 C34.2 ; 30.38,20.06 29.45,20.06 C7.2 ; 30.38,20.06 C6.2 ; C5.2 37.19,18.89 v1(37.19,19.18)
  Top Layer w0.254: U8.3 46.41,42.04 45.01,42.04 46.91,40.13 U8.1 ; SW7.1 28.98,59.06 v1(30.59,60.67) ; 44.84,42.04 44.84,42 v1(44.93,41.92) ; 44.05,42.91 44.05,43.6 C35.2 ; v1(23.43,12.91) 24.22,12.91 L2.2 ; USB2.1 USB2.3 USB2.4 USB2.2 ; R40.2 47.74,53.39 SW11.4 ; 44.01,42.88 v1(43.08,42.88) 41.26,42.88 U8.6 ; C4.2 C3.2 41.47,13.13 C33.1 C32.1 ; SW8.2 38.59,74.55 SW5.2 43.03,78.18 44.92,76.29 47.07,76.29 49.28,74.08 49.28,58.11 SW11.4 ; 44.04,42.9 v1(44.04,42.9) ; v1(37.02,38.38) 35.59,38.38 ; 35.59,38.38 C12.1 ; 35.59,38.38 C13.1 35.64,37.23 35.64,36.16 35.09,35.62 C18.1 29.86,35.14 25.82,35.14 ; R3.1 v1(40.16,3.84) ; L3.1 24.67,9.4 v1(25.13,8.94) ; 44.04,36.27 v1(44.04,40.96) 44.04,41.92 v1(44.04,41.92) 43.09,41.92 v1(43.07,41.94) 41.59,41.94 U8.7 ; C19.1 v1(35.6,45.62) C14.1 v1(35.6,48.09) C15.1 v1(35.6,50.51) C17.1 v1(35.6,52.9) C16.1 36.74,55.25 v1(36.94,55.25) ; SW11.4 v1(45.01,56.56) v1(44.11,56.56) SW11.1 41.55,56.64 v1(40.24,56.64) ; 44.05,41.94 U8.9 ; R4.2 v1(37.62,3.8)
  Top Layer w0.381: v1(39.6,41.78) 40.67,41.78 U8.7 ; C5.2 36.66,17.46 X1.2 37.26,16.19 37.62,16.55 37.62,16.74 37.82,16.94 39.11,16.94 39.31,16.74 39.31,15.65 39.11,15.45 38.92,15.45 X1.4 ; 35.71,24.92 39.83,24.92 40.89,23.86 40.89,21.38 40.69,21.18 37.82,21.18 v1(37.68,21.05) ; 36.24,18.04 37.18,18.98 37.18,19.22 ; R34.2 33.36,29.75 35.03,29.75 35.54,29.24 U7.2 35.54,24.83 ; 41.72,32.89 42.28,32.33 42.53,32.33 42.73,32.12 42.73,31.88 43.55,31.06 43.55,29.38 ; v1(31.99,45.59) 32.02,45.62 v1(35.6,45.62) ; 43.55,29.38 43.57,29.38 ; 43.55,29.38 41.1,29.38 40.25,30.23 38.47,30.23 38.15,30.56 ; v1(13.57,86.11) 16.09,83.58 SW3.C ; 35.54,24.83 35.61,24.83 35.7,24.92 35.7,24.92 ; 35.54,24.83 C29.1 ; R39.1 47.43,39.75 U8.1 ; RF2.3 44.31,8.18 v1(44.31,6.81) 44.31,0.64 v1(44.29,0.62) ; v1(44.1,11.03) 44.09,11.02 v1(44.09,10.27) ; 38.32,30.33 33.91,30.33 33.32,29.75 ; C19.1 33.88,42.73 33.87,42.73 33.75,42.61 33.75,41.43 35.59,39.58 C12.1 ; v1(44.18,15.34) 44.18,18.48 v1(44.34,18.63) 44.34,19.08 44.45,19.2 v1(45.18,19.2) v1(45.92,19.2) v1(46.72,19.2) v1(47.53,19.2) v1(48.29,19.2) v1(49.09,19.2) ; C32.1 43.8,12.79 43.8,13.46 ; CN2.4 v1(44.48,30.02) v1(44.48,31.3) v1(44.48,32.96) CN2.3 41.68,32.88 CN2.2
  Bottom Layer w0.203: SW9.2 7.47,79.5 10.6,79.5 11,79.9 12.81,79.9 13.21,79.5 SW3.C ; v1(42.61,12.92) 40.15,10.46 v1(40.15,9.29) 40.15,3.85 v1(40.16,3.84) 40.13,3.8 v1(37.62,3.8) ; v1(44.29,3.66) 44.29,3.66 ; 37.32,16 37.32,20.68 ; 44.31,6.04 v1(44.29,6.03) ; 44.18,11.11 v1(44.1,11.03) ; 44.9,19.2 v1(44.34,18.63) 44.34,17.79 v1(44.3,17.76) 44.3,17 v1(44.29,16.98) 44.29,16.22 v1(44.22,16.15) ; v1(30.21,21.46) 30.21,21.27 v1(24.02,15.08) 24.02,14.77 24.35,14.44 24.35,13.97 23.43,13.05 v1(23.43,12.91) 25.13,11.21 v1(25.13,8.94) ; 44.29,1.39 44.25,1.36 ; v1(38.13,12.65) 38.13,16.07 ; 44.29,5.25 v1(44.29,5.26) ; v1(44.18,15.34) 44.22,15.38
  Bottom Layer w0.254: USB2.A1 21,90.31 USB2.1 ; SW3.C 17.27,78.32 17.27,63.9 18.25,62.92 28.34,62.92 v1(30.59,60.67) ; USB2.A12 29,90.31 USB2.2
  Bottom Layer w0.381: v1(37.02,38.38) 39.6,40.96 v1(39.6,41.78) ; 37.19,19.12 37.19,16.36 37.27,16.28 ; v1(30.59,60.67) 31.52,60.67 v1(36.94,55.25) 36.94,55.25 38.85,55.25 v1(40.24,56.64) ; v1(44.29,0.62) 44.31,0.64 v1(44.31,6.81) 44.1,7.02 44.1,10.28 ; 37.22,19.11 37.22,20.64 37.67,21.09 ; 44.1,10.28 44.18,10.36 v1(44.18,15.34) 44.18,18.84 44.54,19.2 v1(45.18,19.2) v1(45.92,19.2) v1(46.72,19.2) v1(47.53,19.2) v1(48.29,19.2) v1(49.09,19.2) ; 44.1,10.28 v1(44.09,10.27) ; 44.1,10.28 v1(44.1,11.03) ; U4.3 31.87,45.59 v1(31.99,45.59) ; USB2.1 20.16,89.79 20.16,89.03 arc(20.01,88.68) 19.67,88.54 19.19,88.06 16.74,88.06 14.79,86.11 v1(13.57,86.11)
  vias: v1(2.75,67.5) v1(4.68,19.69) v1(4.68,15.49) v1(4.68,6.1) v1(5.16,76.19) v1(7.09,62.86) v1(7.09,59.72) v1(7.23,19.69) v1(7.23,15.49) v1(7.22,6.1) v1(11.16,88.14) v1(11.16,87.25) v1(12.55,43.43) v1(12.55,41.51) v1(12.68,63.37) v1(12.68,58.29) v1(12.68,54.7) v1(12.94,15.49) v1(13.82,28.26) v1(13.82,26.54) v1(13.82,23.62) v1(14.46,8.89) v1(16.24,86.11) v1(16.24,84.95) v1(17,58.29) v1(21.44,27.05) v1(21.44,17.19) v1(21.82,22.86) v1(21.95,33.53) v1(25,56.79) v1(27.29,36.19) v1(27.29,25.02) v1(29.32,31.37) v1(30.72,29.72) v1(32.41,59.06) v1(32.57,31.37) v1(36.3,85.47) v1(36.3,82.81) v1(37.35,12.67) v1(43.08,40.99) v1(43.29,70.48) v1(43.52,29.42) v1(43.52,28.52) v1(44.29,4.47) v1(44.29,2.85) v1(44.29,2.09) v1(44.29,1.36) v1(44.43,23.37) v1(44.48,28.52) v1(44.99,42.9) v1(44.96,40.95) v1(45.4,29.42) v1(45.43,28.52) v1(46.36,67.44) v1(47.73,74.04) v1(47.99,21.21) v1(48.88,67.44) v1(49,43.05) v1(49,32.13) v1(49,28.45) v1(49.13,56.52)
VBAT: length 27.6
  Top Layer w0.254: 41.13,45.5 C35.1
  Top Layer w0.305: v1(41.13,46.85) 40.7,46.85 v1(40.52,47.02) ; v1(41.13,46.85) 41.13,45.75 ; v1(41.13,46.85) 41.19,46.85 v1(41.63,47.29) ; U8.5 41.05,45.42 C35.1 ; 41.13,45.75 41.13,45.5 ; 41.13,45.75 43.24,47.86 43.24,50.11 Q3.3
  Top Layer w0.381: v1(39.86,33.15) v1(39.86,32.39) 40.61,31.63 CN2.1
  Bottom Layer w0.305: v1(41.13,46.85) 40.21,45.93 40.21,33.5 v1(39.86,33.15) v1(39.86,32.39)
VDD_1.9V: length 28.9
  Top Layer w0.381: U4.4 31.75,44.45 C19.2 32.76,43.01 32.76,40.93 C12.2 C13.2 33.94,37.02 C18.2 25.93,37.02 24.05,35.14 21.36,35.14 R14.2
BT0: length 79.1
  Top Layer w0.203: U1.17 31.41,9.16 31.41,6.98 30.15,5.72 15.31,5.72 v1(15.16,5.57) ; v1(20.24,57.63) 20.38,57.63 SW7.2
  Bottom Layer w0.203: v1(15.16,5.57) 15.16,5.93 11.22,9.87 11.22,43.52 14.9,47.2 14.9,53.05 19.39,57.55 20.16,57.55 v1(20.24,57.63)
BT_L: length 83.5
  Top Layer w0.203: v1(29.55,6.84) 29.61,6.9 29.61,7.62 30.21,8.23 U1.14
  Bottom Layer w0.203: v1(29.55,6.84) 29.92,6.84 29.94,6.83 35.76,6.83 40.3,11.37 40.3,15.51 47.94,23.15 47.94,69.99 44.02,73.91 SW5.3
BT_M: length 85.9
  Top Layer w0.203: U1.15 30.61,7.84 v1(30.17,7.39) ; 30.6,9.18 30.6,9.18
  Bottom Layer w0.254: v1(30.17,7.39) 30.26,7.3 34.86,7.3 39.52,11.95 39.52,17.27 38.38,18.41 38.38,28.95 38.9,29.47 38.9,29.48 41.5,32.08 41.5,46.28 42.59,47.37 42.59,62.32 38.9,66.01 38.9,73.95 35.94,76.91 35.94,79.61 SW8.3
BT_R: length 89.9
  Top Layer w0.203: U1.16 31.01,7.3 29.87,6.16 v1(14.15,6.16)
  Bottom Layer w0.203: SW9.3 7.09,73.79 7.09,70.36 10.75,66.7 10.75,9.55 v1(14.15,6.16)
ENC_1: length 93.7
  Top Layer w0.254: v1(23.79,14.2) 24.08,13.91 24.85,13.91 25.51,13.26 U1.4
  Bottom Layer w0.254: 15.21,74.5 15.14,74.5 13.45,76.19 R20.1 10.13,76.19 9.63,75.69 9.63,70.74 10.75,69.63 arc(11.06,69.49) 11.38,69.63 arc(11.7,69.76) 12.02,69.63 12.46,69.18 arc(12.59,68.86) 12.46,68.55 arc(12.33,68.23) 12.46,67.91 12.9,67.47 arc(13.22,67.34) 13.54,67.47 arc(13.85,67.6) 14.17,67.47 14.61,67.03 arc(14.75,66.71) 14.61,66.39 arc(14.48,66.08) 14.61,65.76 20.68,59.69 27.73,59.69 33.25,54.17 33.25,39.56 23.37,29.68 23.37,14.62 v1(23.79,14.2)
ENC_2: length 93.6
  Top Layer w0.254: 28.91,12.85 25.34,12.85 24.68,13.51 23.4,13.51 v1(23.22,13.69)
  Bottom Layer w0.254: v1(23.22,13.69) 23.22,13.95 22.97,14.2 22.97,26.78 22.71,27.03 22.71,28.3 22.97,28.56 22.97,29.84 32.85,39.73 32.85,54 27.87,58.98 27.29,58.98 26.98,59.28 20.51,59.28 9.23,70.57 9.23,75.86 11.1,77.73 R21.1 14.11,77.73 14.85,77 15.21,77
MISO: length 62.1
  Top Layer w0.203: v1(25.06,4.02) 25.21,4.17 30.32,4.17 32.62,6.47 32.62,9.16 U1.20 ; v1(19.67,30.02) R13.1 19.67,33.01 v1(19.67,33.02)
  Bottom Layer w0.203: v1(25.06,4.02) 25.04,4 23.7,4 19.67,8.03 v1(19.67,30.02)
  Bottom Layer w0.254: U4.12 19.65,48.19 16.58,45.12 16.58,34.83 18.38,33.02 v1(19.67,33.02)
MOSI: length 65
  Top Layer w0.203: U1.21 33.02,9.16 33.02,6.41 30.03,3.42 v1(25.72,3.42)
  Bottom Layer w0.203: v1(25.72,3.42) 23.63,3.42 18.93,8.12 18.93,31.6 15.98,34.55 15.98,45.26 18.7,47.98 18.7,48.92 19.65,49.87 U4.11
MOTION: length 81.2
  Top Layer w0.203: U1.28 37.92,11.26 38.38,10.8 38.38,8.92 v1(38.93,8.37)
  Bottom Layer w0.203: v1(38.93,8.37) 36.48,5.91 33.66,5.91 30.13,2.38 23.24,2.38 17.83,7.8 17.83,31.43 15.09,34.17 15.09,34.25 14.9,34.45 14.9,45.69 17.73,48.52 17.73,51.94 U4.9
NRESET: length 54.7
  Top Layer w0.203: v1(26.42,5.15) 30.01,5.15 31.81,6.95 U1.18
  Bottom Layer w0.203: v1(26.42,5.15) 23.52,5.15 20.31,8.36 20.31,29.39 20.56,29.65 20.56,31.18 20.56,31.18 20.56,33.58 17.57,36.57 17.57,42.45 19.25,44.14 19.43,44.14 19.65,44.36 U4.14
NSS: length 58.2
  Top Layer w0.203: v1(23.94,4.56) 23.97,4.59 29.97,4.59 32.21,6.84 U1.19
  Bottom Layer w0.203: v1(23.94,4.56) 23.58,4.56 20,8.13 20,29.52 20.26,29.77 20.26,31.05 20.25,31.06 20.25,33.26 17.08,36.43 17.08,44.38 19.45,46.75 U4.13
RF: length 4.3
  Top Layer w0.203: R36.2 35.11,12.05 U1.30
SCK: length 78.4
  Top Layer w0.203: U1.29 35.12,11.65 38.28,11.65 38.96,10.97 v1(38.96,9.25)
  Bottom Layer w0.203: v1(38.96,9.25) 36.07,6.36 33.55,6.36 30.05,2.86 23.42,2.86 18.33,7.96 18.33,31.36 15.39,34.29 15.39,45.43 18.18,48.22 18.18,50.62 U4.10
SLE_3V3: length 119.2
  Top Layer w0.203: v1(29.04,9.42) 29.29,9.16 U1.13 ; v1(28.06,15.8) 27.86,16 C8.1 ; C5.1 35.12,14.97 v1(35.1,14.95) ; U1.48 29.41,15.76 v1(29.12,15.76)
  Top Layer w0.381: 35.48,22.51 35.48,18.26 C5.1 ; 35.48,22.51 35.13,22.51 33.95,23.69 ; 35.48,22.51 35.48,23.36 C29.2 38.14,22.23 L6.2 ; 33.95,23.69 33.95,25.61 31.82,27.74 ; 33.95,23.69 25.01,32.62 ; U4.7 30.85,51.69 C17.2 C16.2 35.73,55.64 35.73,56.64 37.89,56.64 38.34,56.2 38.34,33.27 37.32,32.26 35.27,32.26 34.05,33.47 25.8,33.47 23.69,31.37 R13.2
  Bottom Layer w0.381: v1(29.02,8.55) 29.04,8.55 29.04,8.55 v1(29.04,9.42) 29.13,9.51 v1(29.13,15.02) ; v1(29.13,15.02) 29.13,15.75 v1(29.12,15.76) 29.2,15.85 v1(35.1,15.85) ; v1(29.13,15.02) 35.03,15.02 v1(35.1,14.95) ; v1(29.13,15.02) 28.71,15.02 v1(28.46,15.26) 28.06,15.67 v1(28.06,15.8) 27.89,15.64 27.89,9.67 v1(28.15,9.42) 28.15,8.54 28.11,8.57 v1(28.11,8.59)
SLE_DBG_RX: length 7.4
  Top Layer w0.203: U1.23 33.81,1.77
SLE_DBG_TX: length 8.3
  Top Layer w0.203: U1.22 33.41,3.91 H1.5
SLE_USB_N: length 6.4
  Top Layer w0.203: U1.9 28.21,11.26 28.19,11.24 24.8,11.24 L2.1 23.85,11.29 23.61,11.29 23.23,11.68 R11.2
SLE_USB_P: length 6.3
  Top Layer w0.203: R12.2 23.22,10.61 23.55,10.94 23.84,10.94 L3.2 24.69,10.88 28.19,10.88 28.21,10.86 U1.10
SWD_CLK: length 3.6
  Top Layer w0.203: R2.2 H1.2
SWD_DAT: length 3.6
  Top Layer w0.203: R1.2 41.43,1.77
USB_N: length 100.4
  Top Layer w0.254: v1(24.76,88.55) 21.77,88.55 21.41,88.19 14.12,88.19 11.74,85.81 11.74,70.35 15.33,66.75 15.33,29.34 15.51,29.16 15.89,29.16 16.07,28.98 16.07,27.81 15.89,27.63 15.51,27.63 15.33,27.45 15.33,26.29 15.51,26.11 15.89,26.11 16.07,25.93 16.07,24.77 15.89,24.59 15.51,24.59 15.33,24.41 15.33,23.24 15.51,23.06 15.89,23.06 16.07,22.88 16.07,21.72 15.89,21.54 15.51,21.54 15.33,21.36 15.33,12.22 15.93,11.62 18.77,11.62 19.03,11.36 19.29,11.36 19.6,11.67 R9.1
  Bottom Layer w0.254: USB2.A7 25.25,88.9 25,88.65 24.5,88.65 24.25,88.9 USB2.B7
USB_P: length 100.4
  Top Layer w0.254: R10.1 19.64,10.64 19.32,10.95 18.86,10.95 18.6,11.22 15.77,11.22 14.93,12.06 14.93,66.58 11.33,70.18 11.33,85.98 13.96,88.6 21.24,88.6 21.6,88.96 24.22,88.96 25.25,89.99 v1(25.25,90.84)
  Bottom Layer w0.254: USB2.A6 24.75,90.41 25,90.66 25.5,90.66 25.75,90.41 USB2.B6
$1N1713: length 3.8
  Top Layer w0.203: U1.44 31.41,18.53 C6.1
$1N1734: length 6.3
  Top Layer w0.203: U1.46 30.61,17.49 C7.1 28.21,19.89 L1.2
$1N1737: length 4.2
  Top Layer w0.203: L1.1 27.62,17.96 29.17,16.41 29.73,16.41 30.17,15.97 30.17,15.41 U1.47
$1N1785: length 8.1
  Top Layer w0.203: U1.26 35.97,10.46 R3.2
  Top Layer w0.254: R1.1 R3.2
$1N1790: length 6.1
  Top Layer w0.203: U1.25 37.62,7.55 R4.1
  Top Layer w0.254: R2.1 R4.1
$1N1799: length 5.9
  Top Layer w0.203: U1.33 35.99,13.26 36.26,13.54 39.2,13.54 C4.1
$1N1800: length 5.6
  Top Layer w0.203: U1.32 36.02,12.86 ; 36.02,12.86 36.39,13.23 40.04,13.23 C3.1
$1N1801: length 4.8
  Top Layer w0.203: 35.1,13.68 35.95,13.68 36.61,14.34 37.27,14.34 37.42,14.49 37.42,15.21 37.86,15.65 37.92,15.65 X1.1
$1N1802: length 1.9
  Top Layer w0.203: 35.1,14.08 35.75,14.08 X1.3
$1N1817: length 1.2
  Top Layer w0.203: R12.1 21.07,10.61 R10.2
$1N1818: length 1.2
  Top Layer w0.203: R9.2 21.01,11.68 R11.1
$1N1843: length 2.5
  Top Layer w0.203: C1.2 26.45,14.46 U1.1
$1N2592: length 6.6
  Top Layer w0.381: C15.2 C14.2 33.43,47.64 30.35,47.64
$1N2602: length 5.8
  Top Layer w0.254: U4.15 18.52,42.06 18.52,39.49 R14.1
$1N6825: length 1
  Top Layer w0.203: R38.1 43.59,12.05 43.59,12.03
$1N6827: length 2.2
  Top Layer w0.203: R36.1 40.91,12.05 40.93,12.03 42.06,12.03 R38.2
$1N6831: length 1.5
  Top Layer w0.203: R37.1 40.09,10.82 C30.2 39.4,10.84 R35.2
$1N6834: length 2.5
  Top Layer w0.203: R37.2 41.59,10.86 C31.2 41.68,10.86 arc(42.31,10.6) RF2.1
$2N661: length 3
  Top Layer w0.254: v1(23.73,91.04) 23.22,91.55 R31.1
  Bottom Layer w0.254: USB2.A5 23.75,91.02 v1(23.73,91.04)
$2N668: length 3.2
  Top Layer w0.254: v1(26.78,91.06) R30.2
  Bottom Layer w0.254: v1(26.78,91.06) 26.75,91.03 26.75,89.28
$2N1441: length 2.8
  Top Layer w0.381: R33.2 34.49,28.75 U7.5
$2N1447: length 3
  Top Layer w0.381: U7.3 39.45,26.26 39.48,26.28
$2N2318: length 18.9
  Top Layer w0.254: v1(41.11,48.02) 41.12,48.03 Q3.2 ; D52.2 39.42,63.77 SW11.3 41.1,61.02 v1(41.1,60.6)
  Bottom Layer w0.254: v1(41.1,60.6) 41.11,60.59 v1(41.11,48.02)
$2N2325: length 4.2
  Top Layer w0.254: U8.2 47.4,41.4 48.29,40.51 R39.2

## Copper pours and planes (outline as drawn; the poured copper is in the pictures)
5V_STD on Top Layer: 36.19,29.89 40.27,29.89 40.27,28.66 36.19,28.66
GND on Top Layer: 42.39,16.1 43.99,16.1 43.99,13.27 42.39,13.27
GND on Top Layer: 29.04,20.47 30.97,20.47 30.97,19.7 29.04,19.7
GND on Top Layer: -10.37,100.98 61.84,100.98 61.84,-5.05 -10.37,-5.05
GND on Top Layer: 43.77,34.97 45.03,34.97 45.03,29.59 43.77,29.59
GND on Top Layer: 41.14,35.18 44.18,35.18 44.18,32.89 41.14,32.89
GND on Bottom Layer: -10.91,99.7 54.9,99.7 54.9,-2.86 -10.91,-2.86
GND on Bottom Layer: 42.1,44.54 46,44.54 46,39.54 42.1,39.54
GND on Bottom Layer: 35.91,16.92 39.22,16.92 39.22,14.27 35.91,14.27
VBAT on Top Layer: 40.13,47.37 41.87,47.37 41.87,46.57 40.13,46.57
SLE_3V3 on Top Layer: 27.64,9.67 29.81,9.67 29.81,8.28 27.64,8.28
SLE_3V3 on Top Layer: 27.71,16.15 29.81,16.15 29.81,14.87 27.71,14.87
SLE_3V3 on Top Layer: 34.65,18.26 35.62,18.26 35.62,14.36 34.65,14.36
SLE_3V3 on Top Layer: 26.75,9.67 27.89,9.67 27.89,8.38 26.75,8.38
SLE_3V3 on Top Layer: 35.84,24.58 40.55,24.58 40.55,21.53 35.84,21.53
SLE_3V3 on Bottom Layer: 27.71,16.15 35.49,16.15 35.49,14.65 27.71,14.65
SLE_3V3 on Bottom Layer: 27.64,16.2 29.13,16.2 29.13,8.28 27.64,8.28
$1N1734 on Top Layer: 27.76,20.38 29.87,20.38 29.87,18.23 27.76,18.23
$1N1737 on Top Layer: 28.01,17.98 30.32,17.98 30.32,15.85 28.01,15.85
$2N1447 on Top Layer: 36.19,26.99 40.54,26.99 40.54,25.58 36.19,25.58

Small or netless copper shapes (teardrops, artwork), in the pictures only: 1 on Bottom Layer
